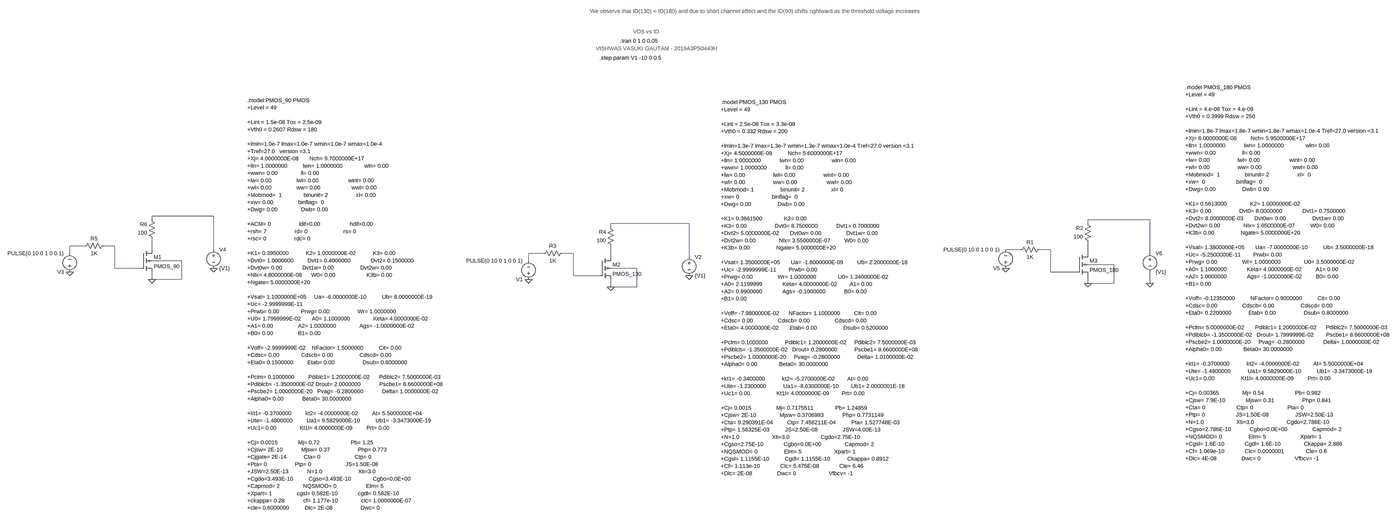
[diagram p0: schematic PMOS_IDvsVGS.asc, whole sheet]
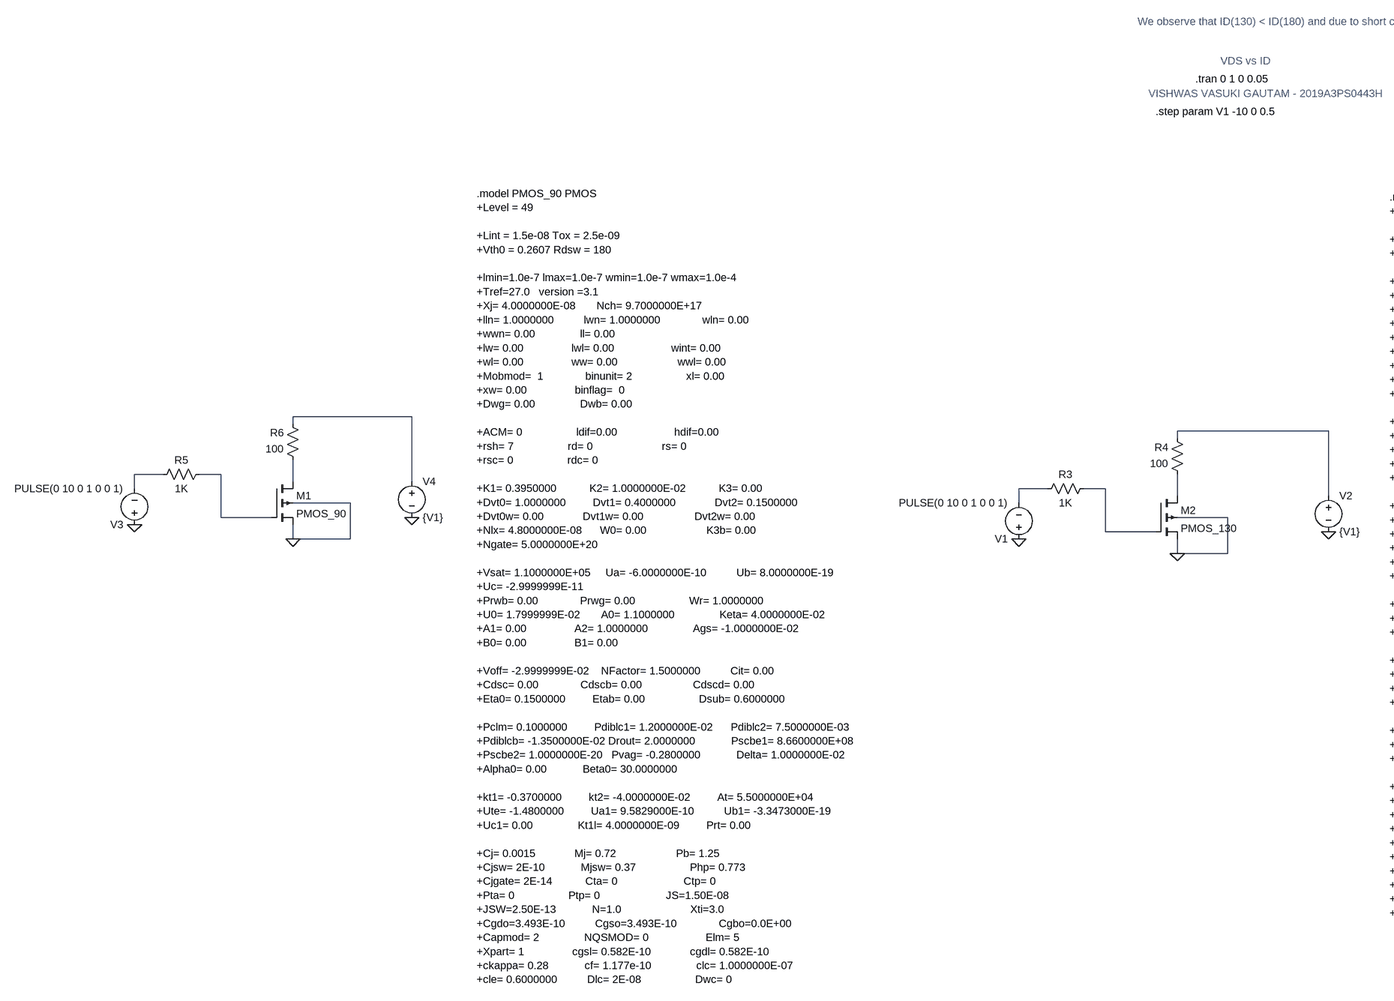
[diagram p1: schematic PMOS_IDvsVGS.asc, part, row 1 of 1, column 1 of 2]
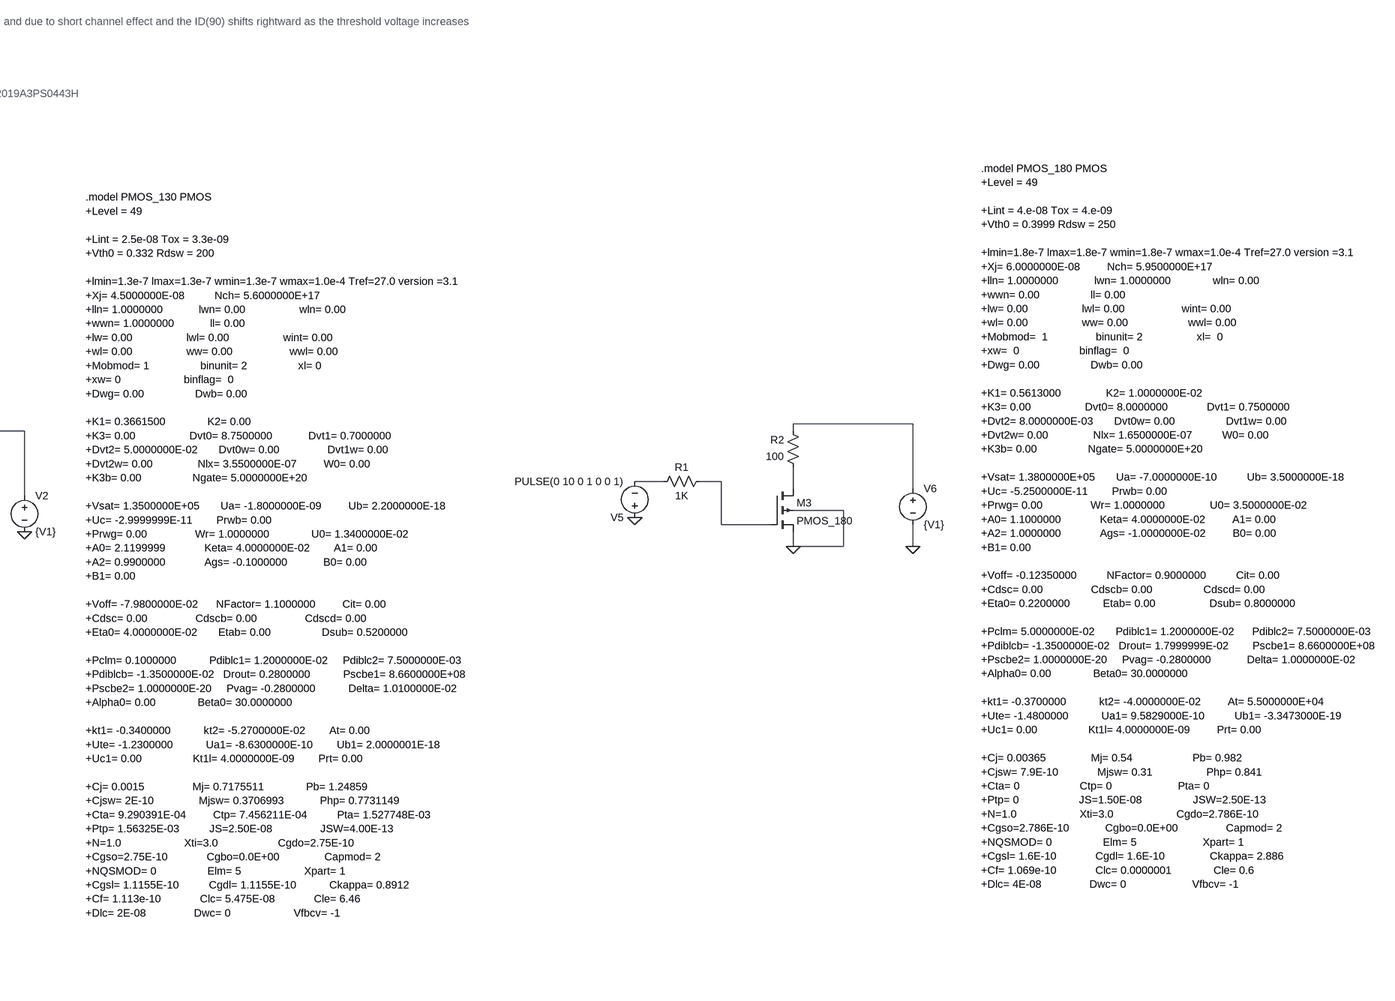
[diagram p2: schematic PMOS_IDvsVGS.asc, part, row 1 of 1, column 2 of 2]
PMOS_IDvsVGS.asc, the LTspice schematic file:
Version 4
SHEET 1 880 680
WIRE -6480 -1136 -6816 -1136
WIRE -6816 -1120 -6816 -1136
WIRE -1920 -1120 -2256 -1120
WIRE -4336 -1104 -4672 -1104
WIRE -2256 -1104 -2256 -1120
WIRE -4672 -1088 -4672 -1104
WIRE -7104 -1008 -7168 -1008
WIRE -6976 -1008 -7024 -1008
WIRE -6816 -992 -6816 -1040
WIRE -6480 -992 -6480 -1136
WIRE -2544 -992 -2608 -992
WIRE -2416 -992 -2464 -992
WIRE -7168 -976 -7168 -1008
WIRE -4960 -976 -5024 -976
WIRE -4832 -976 -4880 -976
WIRE -2256 -976 -2256 -1024
WIRE -1920 -976 -1920 -1120
WIRE -4672 -960 -4672 -1008
WIRE -4336 -960 -4336 -1104
WIRE -6688 -944 -6816 -944
WIRE -5024 -944 -5024 -976
WIRE -2144 -928 -2256 -928
WIRE -6976 -912 -6976 -1008
WIRE -6864 -912 -6976 -912
WIRE -4560 -912 -4672 -912
WIRE -2416 -896 -2416 -992
WIRE -2304 -896 -2416 -896
WIRE -4832 -880 -4832 -976
WIRE -4720 -880 -4832 -880
WIRE -6816 -864 -6816 -896
WIRE -6688 -864 -6688 -944
WIRE -6688 -864 -6816 -864
WIRE -2256 -848 -2256 -880
WIRE -2144 -848 -2144 -928
WIRE -2144 -848 -2256 -848
WIRE -1920 -848 -1920 -896
WIRE -4672 -832 -4672 -864
WIRE -4560 -832 -4560 -912
WIRE -4560 -832 -4672 -832
FLAG -2608 -912 0
FLAG -2256 -848 0
FLAG -1920 -848 0
FLAG -4672 -832 0
FLAG -4336 -880 0
FLAG -5024 -864 0
FLAG -7168 -896 0
FLAG -6816 -864 0
FLAG -6480 -912 0
SYMBOL res -2448 -1008 R90
WINDOW 0 0 56 VBottom 2
WINDOW 3 32 56 VTop 2
SYMATTR InstName R1
SYMATTR Value 1K
SYMBOL res -2240 -1008 R180
WINDOW 0 36 76 Left 2
WINDOW 3 36 40 Left 2
SYMATTR InstName R2
SYMATTR Value 100
SYMBOL res -4864 -992 R90
WINDOW 0 0 56 VBottom 2
WINDOW 3 32 56 VTop 2
SYMATTR InstName R3
SYMATTR Value 1K
SYMBOL res -4656 -992 R180
WINDOW 0 36 76 Left 2
WINDOW 3 36 40 Left 2
SYMATTR InstName R4
SYMATTR Value 100
SYMBOL voltage -5024 -848 R180
WINDOW 123 0 0 Left 2
WINDOW 39 0 0 Left 2
SYMATTR InstName V1
SYMATTR Value PULSE(0 10 0 1 0 0 1)
SYMBOL voltage -4336 -976 R0
WINDOW 123 0 0 Left 2
WINDOW 39 0 0 Left 2
SYMATTR InstName V2
SYMATTR Value {V1}
SYMBOL res -7008 -1024 R90
WINDOW 0 0 56 VBottom 2
WINDOW 3 32 56 VTop 2
SYMATTR InstName R5
SYMATTR Value 1K
SYMBOL res -6800 -1024 R180
WINDOW 0 36 76 Left 2
WINDOW 3 36 40 Left 2
SYMATTR InstName R6
SYMATTR Value 100
SYMBOL voltage -7168 -880 R180
WINDOW 123 0 0 Left 2
WINDOW 39 0 0 Left 2
SYMATTR InstName V3
SYMATTR Value PULSE(0 10 0 1 0 0 1)
SYMBOL voltage -6480 -1008 R0
WINDOW 123 0 0 Left 2
WINDOW 39 0 0 Left 2
SYMATTR InstName V4
SYMATTR Value {V1}
SYMBOL voltage -2608 -896 R180
WINDOW 123 0 0 Left 2
WINDOW 39 0 0 Left 2
SYMATTR InstName V5
SYMATTR Value PULSE(0 10 0 1 0 0 1)
SYMBOL voltage -1920 -992 R0
WINDOW 123 0 0 Left 2
WINDOW 39 0 0 Left 2
SYMATTR InstName V6
SYMATTR Value {V1}
SYMBOL pmos4 -6864 -992 R0
SYMATTR InstName M1
SYMATTR Value PMOS_90
SYMBOL pmos4 -4720 -960 R0
SYMATTR InstName M2
SYMATTR Value PMOS_130
SYMBOL pmos4 -2304 -976 R0
SYMATTR InstName M3
SYMATTR Value PMOS_180
TEXT -4632 -2160 Left 2 !.tran 0 1 0 0.05
TEXT -4720 -2088 Left 2 !.step param V1 -10 0 0.5
TEXT -4760 -2288 Left 2 ;We observe that ID(130) < ID(180) and due to short channel effect and the ID(90) shifts rightward as the threshold voltage increases
TEXT -4576 -2200 Left 2 ;VDS vs ID
TEXT -1768 -1688 Left 2 !.model PMOS_180 PMOS\n+Level = 49\n \n+Lint = 4.e-08 Tox = 4.e-09 \n+Vth0 = 0.3999 Rdsw = 250 \n \n+lmin=1.8e-7 lmax=1.8e-7 wmin=1.8e-7 wmax=1.0e-4 Tref=27.0 version =3.1\n+Xj= 6.0000000E-08         Nch= 5.9500000E+17 \n+lln= 1.0000000            lwn= 1.0000000              wln= 0.00\n+wwn= 0.00                 ll= 0.00\n+lw= 0.00                  lwl= 0.00                   wint= 0.00\n+wl= 0.00                  ww= 0.00                    wwl= 0.00\n+Mobmod=  1                binunit= 2                  xl=  0\n+xw=  0                    binflag=  0\n+Dwg= 0.00                 Dwb= 0.00 \n \n+K1= 0.5613000               K2= 1.0000000E-02 \n+K3= 0.00                  Dvt0= 8.0000000             Dvt1= 0.7500000 \n+Dvt2= 8.0000000E-03       Dvt0w= 0.00                 Dvt1w= 0.00 \n+Dvt2w= 0.00               Nlx= 1.6500000E-07          W0= 0.00 \n+K3b= 0.00                 Ngate= 5.0000000E+20 \n \n+Vsat= 1.3800000E+05       Ua= -7.0000000E-10          Ub= 3.5000000E-18 \n+Uc= -5.2500000E-11        Prwb= 0.00 \n+Prwg= 0.00                Wr= 1.0000000               U0= 3.5000000E-02 \n+A0= 1.1000000             Keta= 4.0000000E-02         A1= 0.00 \n+A2= 1.0000000             Ags= -1.0000000E-02         B0= 0.00 \n+B1= 0.00 \n \n+Voff= -0.12350000          NFactor= 0.9000000          Cit= 0.00 \n+Cdsc= 0.00                Cdscb= 0.00                 Cdscd= 0.00 \n+Eta0= 0.2200000           Etab= 0.00                  Dsub= 0.8000000 \n \n+Pclm= 5.0000000E-02       Pdiblc1= 1.2000000E-02      Pdiblc2= 7.5000000E-03 \n+Pdiblcb= -1.3500000E-02   Drout= 1.7999999E-02        Pscbe1= 8.6600000E+08 \n+Pscbe2= 1.0000000E-20     Pvag= -0.2800000            Delta= 1.0000000E-02 \n+Alpha0= 0.00              Beta0= 30.0000000 \n \n+kt1= -0.3700000           kt2= -4.0000000E-02         At= 5.5000000E+04 \n+Ute= -1.4800000           Ua1= 9.5829000E-10          Ub1= -3.3473000E-19 \n+Uc1= 0.00                 Kt1l= 4.0000000E-09         Prt= 0.00 \n \n+Cj= 0.00365               Mj= 0.54                    Pb= 0.982\n+Cjsw= 7.9E-10             Mjsw= 0.31                  Php= 0.841\n+Cta= 0                    Ctp= 0                      Pta= 0\n+Ptp= 0                    JS=1.50E-08                 JSW=2.50E-13\n+N=1.0                     Xti=3.0                     Cgdo=2.786E-10\n+Cgso=2.786E-10            Cgbo=0.0E+00                Capmod= 2\n+NQSMOD= 0                 Elm= 5                      Xpart= 1\n+Cgsl= 1.6E-10             Cgdl= 1.6E-10               Ckappa= 2.886\n+Cf= 1.069e-10             Clc= 0.0000001              Cle= 0.6\n+Dlc= 4E-08                Dwc= 0                      Vfbcv= -1
TEXT -4200 -1624 Left 2 !.model PMOS_130 PMOS\n+Level = 49\n \n+Lint = 2.5e-08 Tox = 3.3e-09 \n+Vth0 = 0.332 Rdsw = 200 \n \n+lmin=1.3e-7 lmax=1.3e-7 wmin=1.3e-7 wmax=1.0e-4 Tref=27.0 version =3.1\n+Xj= 4.5000000E-08          Nch= 5.6000000E+17 \n+lln= 1.0000000            lwn= 0.00                  wln= 0.00\n+wwn= 1.0000000            ll= 0.00\n+lw= 0.00                  lwl= 0.00                  wint= 0.00\n+wl= 0.00                  ww= 0.00                   wwl= 0.00\n+Mobmod= 1                 binunit= 2                 xl= 0\n+xw= 0                     binflag=  0\n+Dwg= 0.00                 Dwb= 0.00 \n \n+K1= 0.3661500              K2= 0.00 \n+K3= 0.00                  Dvt0= 8.7500000            Dvt1= 0.7000000 \n+Dvt2= 5.0000000E-02       Dvt0w= 0.00                Dvt1w= 0.00 \n+Dvt2w= 0.00               Nlx= 3.5500000E-07         W0= 0.00 \n+K3b= 0.00                 Ngate= 5.0000000E+20 \n \n+Vsat= 1.3500000E+05       Ua= -1.8000000E-09         Ub= 2.2000000E-18 \n+Uc= -2.9999999E-11        Prwb= 0.00 \n+Prwg= 0.00                Wr= 1.0000000              U0= 1.3400000E-02 \n+A0= 2.1199999             Keta= 4.0000000E-02        A1= 0.00 \n+A2= 0.9900000             Ags= -0.1000000            B0= 0.00 \n+B1= 0.00 \n \n+Voff= -7.9800000E-02      NFactor= 1.1000000         Cit= 0.00 \n+Cdsc= 0.00                Cdscb= 0.00                Cdscd= 0.00 \n+Eta0= 4.0000000E-02       Etab= 0.00                 Dsub= 0.5200000 \n \n+Pclm= 0.1000000           Pdiblc1= 1.2000000E-02     Pdiblc2= 7.5000000E-03 \n+Pdiblcb= -1.3500000E-02   Drout= 0.2800000           Pscbe1= 8.6600000E+08 \n+Pscbe2= 1.0000000E-20     Pvag= -0.2800000           Delta= 1.0100000E-02 \n+Alpha0= 0.00              Beta0= 30.0000000 \n \n+kt1= -0.3400000           kt2= -5.2700000E-02        At= 0.00 \n+Ute= -1.2300000           Ua1= -8.6300000E-10        Ub1= 2.0000001E-18 \n+Uc1= 0.00                 Kt1l= 4.0000000E-09        Prt= 0.00 \n \n+Cj= 0.0015                Mj= 0.7175511              Pb= 1.24859\n+Cjsw= 2E-10               Mjsw= 0.3706993            Php= 0.7731149\n+Cta= 9.290391E-04         Ctp= 7.456211E-04          Pta= 1.527748E-03\n+Ptp= 1.56325E-03          JS=2.50E-08                JSW=4.00E-13\n+N=1.0                     Xti=3.0                    Cgdo=2.75E-10\n+Cgso=2.75E-10             Cgbo=0.0E+00               Capmod= 2\n+NQSMOD= 0                 Elm= 5                     Xpart= 1\n+Cgsl= 1.1155E-10          Cgdl= 1.1155E-10           Ckappa= 0.8912\n+Cf= 1.113e-10             Clc= 5.475E-08             Cle= 6.46\n+Dlc= 2E-08                Dwc= 0                     Vfbcv= -1
TEXT -6336 -1632 Left 2 !.model PMOS_90 PMOS\n+Level = 49\n \n+Lint = 1.5e-08 Tox = 2.5e-09 \n+Vth0 = 0.2607 Rdsw = 180 \n \n+lmin=1.0e-7 lmax=1.0e-7 wmin=1.0e-7 wmax=1.0e-4\n+Tref=27.0   version =3.1\n+Xj= 4.0000000E-08       Nch= 9.7000000E+17 \n+lln= 1.0000000          lwn= 1.0000000              wln= 0.00\n+wwn= 0.00               ll= 0.00\n+lw= 0.00                lwl= 0.00                   wint= 0.00\n+wl= 0.00                ww= 0.00                    wwl= 0.00\n+Mobmod=  1              binunit= 2                  xl= 0.00\n+xw= 0.00                binflag=  0\n+Dwg= 0.00               Dwb= 0.00 \n \n+ACM= 0                  ldif=0.00                   hdif=0.00\n+rsh= 7                  rd= 0                       rs= 0\n+rsc= 0                  rdc= 0\n \n+K1= 0.3950000           K2= 1.0000000E-02           K3= 0.00 \n+Dvt0= 1.0000000         Dvt1= 0.4000000             Dvt2= 0.1500000 \n+Dvt0w= 0.00             Dvt1w= 0.00                 Dvt2w= 0.00 \n+Nlx= 4.8000000E-08      W0= 0.00                    K3b= 0.00 \n+Ngate= 5.0000000E+20 \n \n+Vsat= 1.1000000E+05     Ua= -6.0000000E-10          Ub= 8.0000000E-19 \n+Uc= -2.9999999E-11       \n+Prwb= 0.00              Prwg= 0.00                  Wr= 1.0000000 \n+U0= 1.7999999E-02       A0= 1.1000000               Keta= 4.0000000E-02 \n+A1= 0.00                A2= 1.0000000               Ags= -1.0000000E-02\n+B0= 0.00                B1= 0.00 \n \n+Voff= -2.9999999E-02    NFactor= 1.5000000          Cit= 0.00 \n+Cdsc= 0.00              Cdscb= 0.00                 Cdscd= 0.00 \n+Eta0= 0.1500000         Etab= 0.00                  Dsub= 0.6000000 \n \n+Pclm= 0.1000000         Pdiblc1= 1.2000000E-02      Pdiblc2= 7.5000000E-03\n+Pdiblcb= -1.3500000E-02 Drout= 2.0000000            Pscbe1= 8.6600000E+08\n+Pscbe2= 1.0000000E-20   Pvag= -0.2800000            Delta= 1.0000000E-02\n+Alpha0= 0.00            Beta0= 30.0000000 \n \n+kt1= -0.3700000         kt2= -4.0000000E-02         At= 5.5000000E+04 \n+Ute= -1.4800000         Ua1= 9.5829000E-10          Ub1= -3.3473000E-19\n+Uc1= 0.00               Kt1l= 4.0000000E-09         Prt= 0.00 \n \n+Cj= 0.0015             Mj= 0.72                    Pb= 1.25 \n+Cjsw= 2E-10            Mjsw= 0.37                  Php= 0.773\n+Cjgate= 2E-14           Cta= 0                      Ctp= 0\n+Pta= 0                  Ptp= 0                      JS=1.50E-08\n+JSW=2.50E-13            N=1.0                       Xti=3.0\n+Cgdo=3.493E-10          Cgso=3.493E-10              Cgbo=0.0E+00\n+Capmod= 2               NQSMOD= 0                   Elm= 5\n+Xpart= 1                cgsl= 0.582E-10             cgdl= 0.582E-10\n+ckappa= 0.28            cf= 1.177e-10               clc= 1.0000000E-07\n+cle= 0.6000000          Dlc= 2E-08                  Dwc= 0
TEXT -4736 -2128 Left 2 ;VISHWAS VASUKI GAUTAM - 2019A3PS0443H

The netlist it stands for:
* PMOS_IDvsVGS.asc
R1 N008 N007 1K
R2 N011 N002 100
R3 N010 N009 1K
R4 N012 N003 100
V1 0 N009 PULSE(0 10 0 1 0 0 1)
V2 N003 0 {V1}
R5 N005 N004 1K
R6 N006 N001 100
V3 0 N004 PULSE(0 10 0 1 0 0 1)
V4 N001 0 {V1}
V5 0 N007 PULSE(0 10 0 1 0 0 1)
V6 N002 0 {V1}
M1 N006 N005 0 0 PMOS_90
M2 N012 N010 0 0 PMOS_130
M3 N011 N008 0 0 PMOS_180
.model NMOS NMOS
.model PMOS PMOS
.lib standard.mos
.tran 0 1 0 0.05
.step param V1 -10 0 0.5
* We observe that ID(130) < ID(180) and due to short channel effect and the ID(90) shifts rightward as the threshold voltage increases
* VDS vs ID
.model PMOS_180 PMOS
+Level = 49
+Lint = 4.e-08 Tox = 4.e-09
+Vth0 = 0.3999 Rdsw = 250
+lmin=1.8e-7 lmax=1.8e-7 wmin=1.8e-7 wmax=1.0e-4 Tref=27.0 version =3.1
+Xj= 6.0000000E-08         Nch= 5.9500000E+17
+lln= 1.0000000            lwn= 1.0000000              wln= 0.00
+wwn= 0.00                 ll= 0.00
+lw= 0.00                  lwl= 0.00                   wint= 0.00
+wl= 0.00                  ww= 0.00                    wwl= 0.00
+Mobmod=  1                binunit= 2                  xl=  0
+xw=  0                    binflag=  0
+Dwg= 0.00                 Dwb= 0.00
+K1= 0.5613000               K2= 1.0000000E-02
+K3= 0.00                  Dvt0= 8.0000000             Dvt1= 0.7500000
+Dvt2= 8.0000000E-03       Dvt0w= 0.00                 Dvt1w= 0.00
+Dvt2w= 0.00               Nlx= 1.6500000E-07          W0= 0.00
+K3b= 0.00                 Ngate= 5.0000000E+20
+Vsat= 1.3800000E+05       Ua= -7.0000000E-10          Ub= 3.5000000E-18
+Uc= -5.2500000E-11        Prwb= 0.00
+Prwg= 0.00                Wr= 1.0000000               U0= 3.5000000E-02
+A0= 1.1000000             Keta= 4.0000000E-02         A1= 0.00
+A2= 1.0000000             Ags= -1.0000000E-02         B0= 0.00
+B1= 0.00
+Voff= -0.12350000          NFactor= 0.9000000          Cit= 0.00
+Cdsc= 0.00                Cdscb= 0.00                 Cdscd= 0.00
+Eta0= 0.2200000           Etab= 0.00                  Dsub= 0.8000000
+Pclm= 5.0000000E-02       Pdiblc1= 1.2000000E-02      Pdiblc2= 7.5000000E-03
+Pdiblcb= -1.3500000E-02   Drout= 1.7999999E-02        Pscbe1= 8.6600000E+08
+Pscbe2= 1.0000000E-20     Pvag= -0.2800000            Delta= 1.0000000E-02
+Alpha0= 0.00              Beta0= 30.0000000
+kt1= -0.3700000           kt2= -4.0000000E-02         At= 5.5000000E+04
+Ute= -1.4800000           Ua1= 9.5829000E-10          Ub1= -3.3473000E-19
+Uc1= 0.00                 Kt1l= 4.0000000E-09         Prt= 0.00
+Cj= 0.00365               Mj= 0.54                    Pb= 0.982
+Cjsw= 7.9E-10             Mjsw= 0.31                  Php= 0.841
+Cta= 0                    Ctp= 0                      Pta= 0
+Ptp= 0                    JS=1.50E-08                 JSW=2.50E-13
+N=1.0                     Xti=3.0                     Cgdo=2.786E-10
+Cgso=2.786E-10            Cgbo=0.0E+00                Capmod= 2
+NQSMOD= 0                 Elm= 5                      Xpart= 1
+Cgsl= 1.6E-10             Cgdl= 1.6E-10               Ckappa= 2.886
+Cf= 1.069e-10             Clc= 0.0000001              Cle= 0.6
+Dlc= 4E-08                Dwc= 0                      Vfbcv= -1
.model PMOS_130 PMOS
+Level = 49
+Lint = 2.5e-08 Tox = 3.3e-09
+Vth0 = 0.332 Rdsw = 200
+lmin=1.3e-7 lmax=1.3e-7 wmin=1.3e-7 wmax=1.0e-4 Tref=27.0 version =3.1
+Xj= 4.5000000E-08          Nch= 5.6000000E+17
+lln= 1.0000000            lwn= 0.00                  wln= 0.00
+wwn= 1.0000000            ll= 0.00
+lw= 0.00                  lwl= 0.00                  wint= 0.00
+wl= 0.00                  ww= 0.00                   wwl= 0.00
+Mobmod= 1                 binunit= 2                 xl= 0
+xw= 0                     binflag=  0
+Dwg= 0.00                 Dwb= 0.00
+K1= 0.3661500              K2= 0.00
+K3= 0.00                  Dvt0= 8.7500000            Dvt1= 0.7000000
+Dvt2= 5.0000000E-02       Dvt0w= 0.00                Dvt1w= 0.00
+Dvt2w= 0.00               Nlx= 3.5500000E-07         W0= 0.00
+K3b= 0.00                 Ngate= 5.0000000E+20
+Vsat= 1.3500000E+05       Ua= -1.8000000E-09         Ub= 2.2000000E-18
+Uc= -2.9999999E-11        Prwb= 0.00
+Prwg= 0.00                Wr= 1.0000000              U0= 1.3400000E-02
+A0= 2.1199999             Keta= 4.0000000E-02        A1= 0.00
+A2= 0.9900000             Ags= -0.1000000            B0= 0.00
+B1= 0.00
+Voff= -7.9800000E-02      NFactor= 1.1000000         Cit= 0.00
+Cdsc= 0.00                Cdscb= 0.00                Cdscd= 0.00
+Eta0= 4.0000000E-02       Etab= 0.00                 Dsub= 0.5200000
+Pclm= 0.1000000           Pdiblc1= 1.2000000E-02     Pdiblc2= 7.5000000E-03
+Pdiblcb= -1.3500000E-02   Drout= 0.2800000           Pscbe1= 8.6600000E+08
+Pscbe2= 1.0000000E-20     Pvag= -0.2800000           Delta= 1.0100000E-02
+Alpha0= 0.00              Beta0= 30.0000000
+kt1= -0.3400000           kt2= -5.2700000E-02        At= 0.00
+Ute= -1.2300000           Ua1= -8.6300000E-10        Ub1= 2.0000001E-18
+Uc1= 0.00                 Kt1l= 4.0000000E-09        Prt= 0.00
+Cj= 0.0015                Mj= 0.7175511              Pb= 1.24859
+Cjsw= 2E-10               Mjsw= 0.3706993            Php= 0.7731149
+Cta= 9.290391E-04         Ctp= 7.456211E-04          Pta= 1.527748E-03
+Ptp= 1.56325E-03          JS=2.50E-08                JSW=4.00E-13
+N=1.0                     Xti=3.0                    Cgdo=2.75E-10
+Cgso=2.75E-10             Cgbo=0.0E+00               Capmod= 2
+NQSMOD= 0                 Elm= 5                     Xpart= 1
+Cgsl= 1.1155E-10          Cgdl= 1.1155E-10           Ckappa= 0.8912
+Cf= 1.113e-10             Clc= 5.475E-08             Cle= 6.46
+Dlc= 2E-08                Dwc= 0                     Vfbcv= -1
.model PMOS_90 PMOS
+Level = 49
+Lint = 1.5e-08 Tox = 2.5e-09
+Vth0 = 0.2607 Rdsw = 180
+lmin=1.0e-7 lmax=1.0e-7 wmin=1.0e-7 wmax=1.0e-4
+Tref=27.0   version =3.1
+Xj= 4.0000000E-08       Nch= 9.7000000E+17
+lln= 1.0000000          lwn= 1.0000000              wln= 0.00
+wwn= 0.00               ll= 0.00
+lw= 0.00                lwl= 0.00                   wint= 0.00
+wl= 0.00                ww= 0.00                    wwl= 0.00
+Mobmod=  1              binunit= 2                  xl= 0.00
+xw= 0.00                binflag=  0
+Dwg= 0.00               Dwb= 0.00
+ACM= 0                  ldif=0.00                   hdif=0.00
+rsh= 7                  rd= 0                       rs= 0
+rsc= 0                  rdc= 0
+K1= 0.3950000           K2= 1.0000000E-02           K3= 0.00
+Dvt0= 1.0000000         Dvt1= 0.4000000             Dvt2= 0.1500000
+Dvt0w= 0.00             Dvt1w= 0.00                 Dvt2w= 0.00
+Nlx= 4.8000000E-08      W0= 0.00                    K3b= 0.00
+Ngate= 5.0000000E+20
+Vsat= 1.1000000E+05     Ua= -6.0000000E-10          Ub= 8.0000000E-19
+Uc= -2.9999999E-11
+Prwb= 0.00              Prwg= 0.00                  Wr= 1.0000000
+U0= 1.7999999E-02       A0= 1.1000000               Keta= 4.0000000E-02
+A1= 0.00                A2= 1.0000000               Ags= -1.0000000E-02
+B0= 0.00                B1= 0.00
+Voff= -2.9999999E-02    NFactor= 1.5000000          Cit= 0.00
+Cdsc= 0.00              Cdscb= 0.00                 Cdscd= 0.00
+Eta0= 0.1500000         Etab= 0.00                  Dsub= 0.6000000
+Pclm= 0.1000000         Pdiblc1= 1.2000000E-02      Pdiblc2= 7.5000000E-03
+Pdiblcb= -1.3500000E-02 Drout= 2.0000000            Pscbe1= 8.6600000E+08
+Pscbe2= 1.0000000E-20   Pvag= -0.2800000            Delta= 1.0000000E-02
+Alpha0= 0.00            Beta0= 30.0000000
+kt1= -0.3700000         kt2= -4.0000000E-02         At= 5.5000000E+04
+Ute= -1.4800000         Ua1= 9.5829000E-10          Ub1= -3.3473000E-19
+Uc1= 0.00               Kt1l= 4.0000000E-09         Prt= 0.00
+Cj= 0.0015             Mj= 0.72                    Pb= 1.25
+Cjsw= 2E-10            Mjsw= 0.37                  Php= 0.773
+Cjgate= 2E-14           Cta= 0                      Ctp= 0
+Pta= 0                  Ptp= 0                      JS=1.50E-08
+JSW=2.50E-13            N=1.0                       Xti=3.0
+Cgdo=3.493E-10          Cgso=3.493E-10              Cgbo=0.0E+00
+Capmod= 2               NQSMOD= 0                   Elm= 5
+Xpart= 1                cgsl= 0.582E-10             cgdl= 0.582E-10
+ckappa= 0.28            cf= 1.177e-10               clc= 1.0000000E-07
+cle= 0.6000000          Dlc= 2E-08                  Dwc= 0
* VISHWAS VASUKI GAUTAM - 2019A3PS0443H
.backanno
.end